# EAGLE design ez-retro-v2 (EAGLE 7.6.0)
CNAME: EZ-Retro; CREVISION: 2; DESIGNER: Jean-Claude Wippler
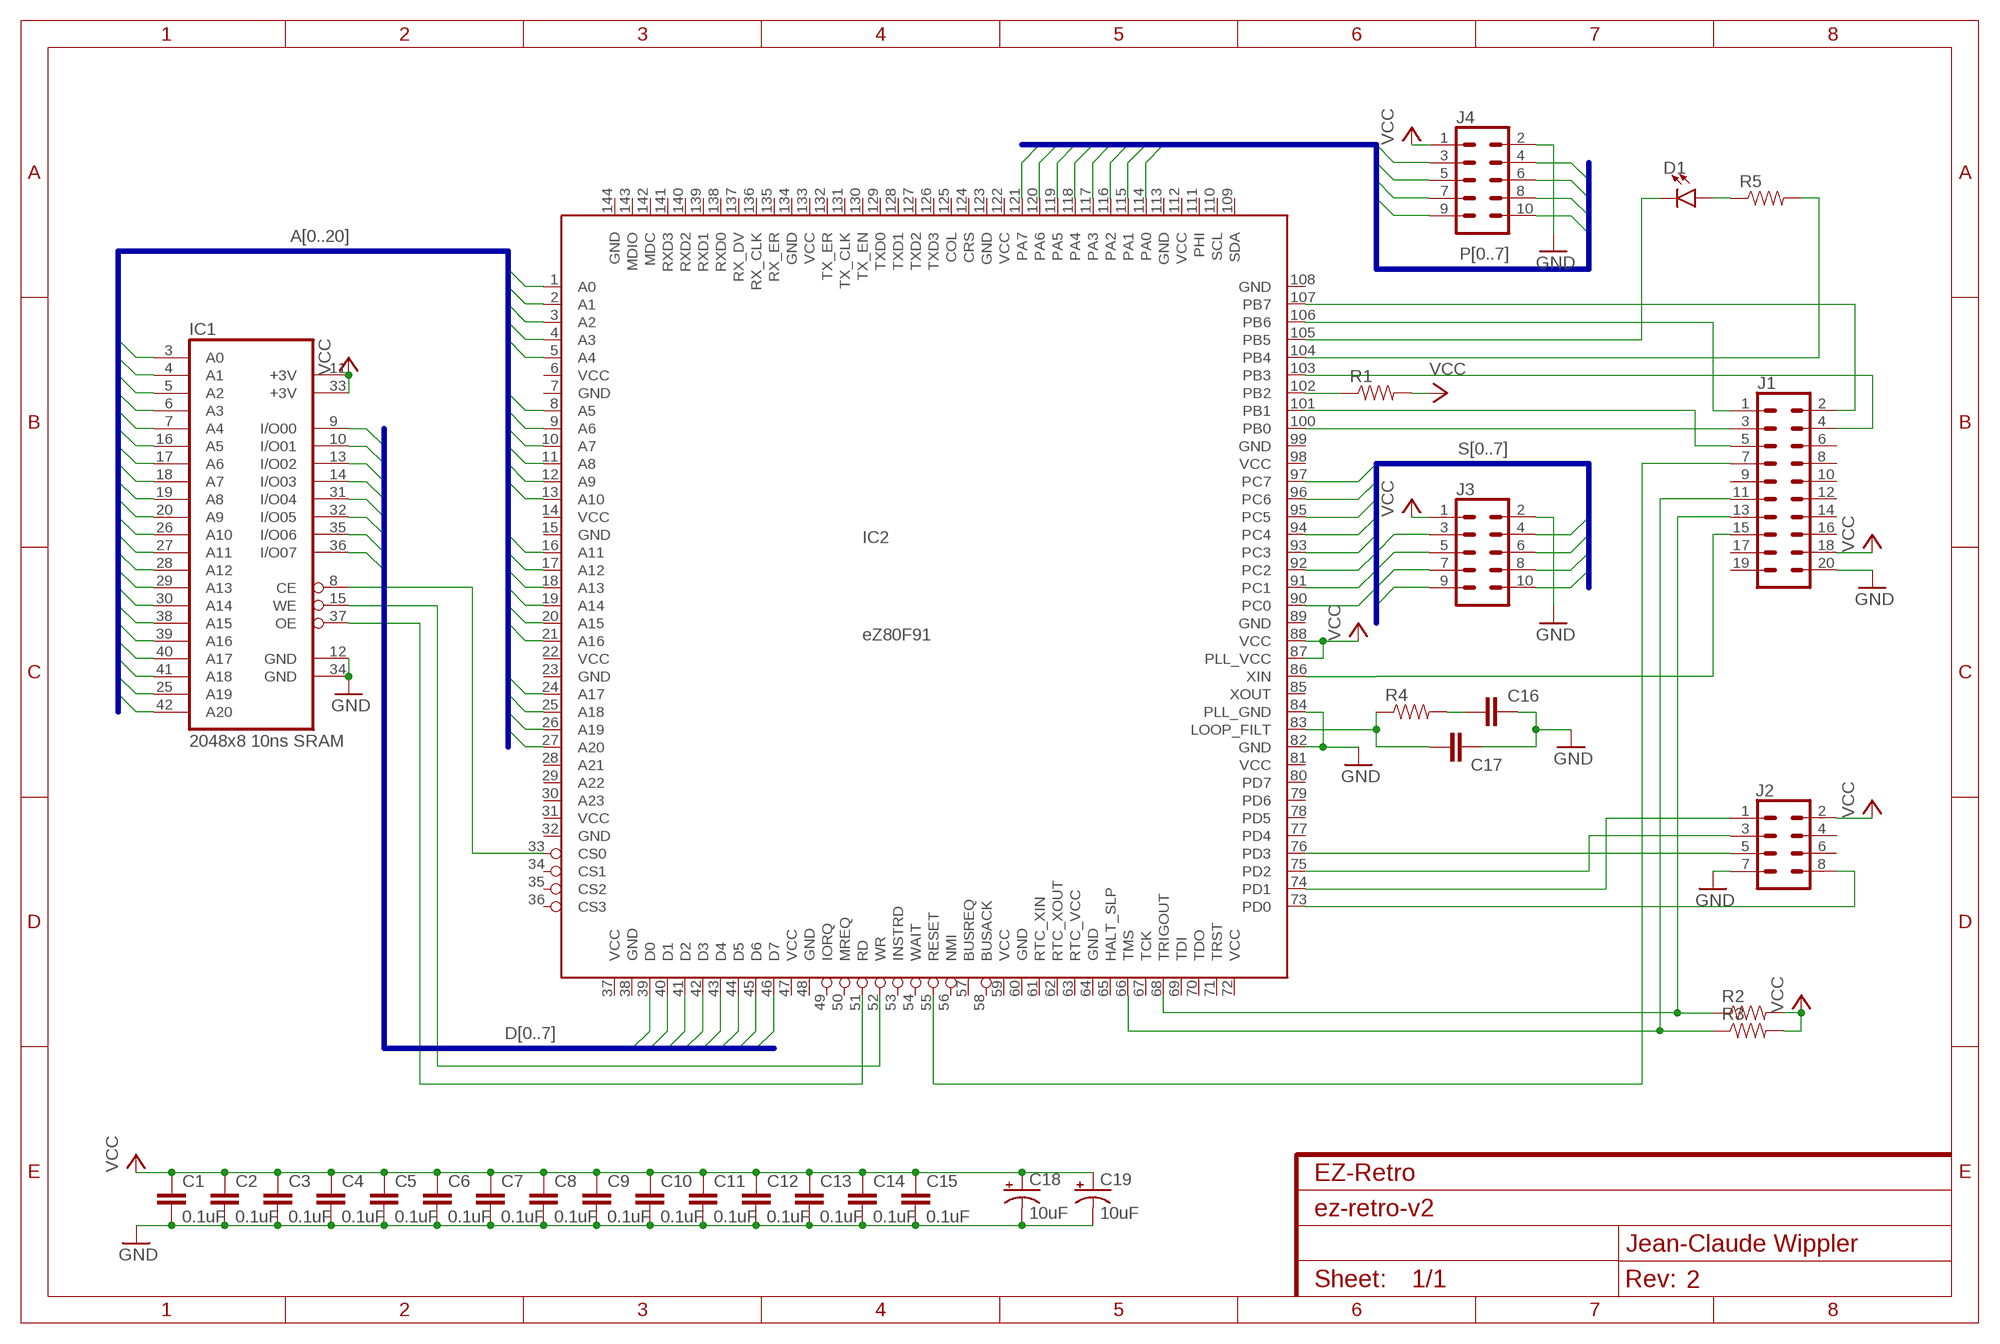
[diagram p0: schematic, sheet 1]

## Parts
C1  0.1uF  0.1UF-0603-25V-(+80/-20%)  [0603]
C2  0.1uF  0.1UF-0603-25V-(+80/-20%)  [0603]
C3  0.1uF  0.1UF-0603-25V-(+80/-20%)  [0603]
C4  0.1uF  0.1UF-0603-25V-(+80/-20%)  [0603]
C5  0.1uF  0.1UF-0603-25V-(+80/-20%)  [0603]
C6  0.1uF  0.1UF-0603-25V-(+80/-20%)  [0603]
C7  0.1uF  0.1UF-0603-25V-(+80/-20%)  [0603]
C8  0.1uF  0.1UF-0603-25V-(+80/-20%)  [0603]
C9  0.1uF  0.1UF-0603-25V-(+80/-20%)  [0603]
C10  0.1uF  0.1UF-0603-25V-(+80/-20%)  [0603]
C11  0.1uF  0.1UF-0603-25V-(+80/-20%)  [0603]
C12  0.1uF  0.1UF-0603-25V-(+80/-20%)  [0603]
C13  0.1uF  0.1UF-0603-25V-(+80/-20%)  [0603]
C14  0.1uF  0.1UF-0603-25V-(+80/-20%)  [0603]
C15  0.1uF  0.1UF-0603-25V-(+80/-20%)  [0603]
C16  0.1uF  0.1UF-0603-25V-(+80/-20%)  [0603]
C17  0.1uF  0.1UF-0603-25V-(+80/-20%)  [0603]
C18  10uF  10UF-POLAR-EIA3216-16V-10%(TANT)  [EIA3216]
C19  10uF  10UF-POLAR-EIA3216-16V-10%(TANT)  [EIA3216]
D1  LED1206  [LED-1206]
IC1  2048x8 10ns SRAM  CY7C1059DV33-10ZSXI  [TSOPII-Z44]
IC2  eZ80F91  EZ80F91-T144  [TQFP144]
J1  CONN_10X2NOSILK  [2X10_NOSILK]
J2  CONN_04X2  [2X4]
J3  CONN_05X2NO_SILK  [2X5_NOSILK]
J4  CONN_05X2NO_SILK  [2X5_NOSILK]
R1  RESISTOR0603-RES  [0603-RES]
R2  RESISTOR0603-RES  [0603-RES]
R3  RESISTOR0603-RES  [0603-RES]
R4  RESISTOR0603-RES  [0603-RES]
R5  RESISTOR0603-RES  [0603-RES]

## Nets
A0: IC1.3(A0) IC2.1(A0)
A1: IC1.4(A1) IC2.2(A1)
A2: IC1.5(A2) IC2.3(A2)
A3: IC1.6(A3) IC2.4(A3)
A4: IC1.7(A4) IC2.5(A4)
A5: IC1.16(A5) IC2.8(A5)
A6: IC1.17(A6) IC2.9(A6)
A7: IC1.18(A7) IC2.10(A7)
A8: IC1.19(A8) IC2.11(A8)
A9: IC1.20(A9) IC2.12(A9)
A10: IC1.26(A10) IC2.13(A10)
A11: IC1.27(A11) IC2.16(A11)
A12: IC1.28(A12) IC2.17(A12)
A13: IC1.29(A13) IC2.18(A13)
A14: IC1.30(A14) IC2.19(A14)
A15: IC1.38(A15) IC2.20(A15)
A16: IC1.39(A16) IC2.21(A16)
A17: IC1.40(A17) IC2.24(A17)
A18: IC1.41(A18) IC2.25(A18)
A19: IC1.25(A19) IC2.26(A19)
A20: IC1.42(A20) IC2.27(A20)
D0: IC1.9(I/O00) IC2.39(D0)
D1: IC1.10(I/O01) IC2.40(D1)
D2: IC1.13(I/O02) IC2.41(D2)
D3: IC1.14(I/O03) IC2.42(D3)
D4: IC1.31(I/O04) IC2.43(D4)
D5: IC1.32(I/O05) IC2.44(D5)
D6: IC1.35(I/O06) IC2.45(D6)
D7: IC1.36(I/O07) IC2.46(D7)
GND [power]: C1.2 C2.2 C3.2 C4.2 C5.2 C6.2 C7.2 C8.2 C9.1 C10.2 C11.2 C12.2 C13.2 C14.2 C15.2 C16.2 C17.2 C18.- C19.- IC1.12(GND) IC1.34(GND) IC2.82(GND) IC2.84(PLL_GND) J1.20 J2.7 J3.2 J4.2
N$1: IC1.37(OE) IC2.51(RD)
N$2: IC1.15(WE) IC2.52(WR)
N$3: IC1.8(CE) IC2.33(CS0)
N$4: IC2.100(PB0) J1.3
N$5: IC2.106(PB6) J1.1
N$6: IC2.103(PB3) J1.4
N$7: IC2.107(PB7) J1.2
N$8: IC2.86(XIN) J1.15
N$9: IC2.55(RESET) J1.7
N$10: IC2.101(PB1) J1.5
N$11: IC2.66(TMS) J1.11 R3.1
N$12: IC2.102(PB2) R1.1
N$13: IC2.68(TRIGOUT) J1.13 R2.1
N$14: IC2.74(PD1) J2.1
N$15: IC2.73(PD0) J2.8
N$16: IC2.76(PD3) J2.5
N$17: IC2.75(PD2) J2.3
N$18: C17.1 IC2.83(LOOP_FILT) R4.1
N$19: C16.1 R4.2
N$20: D1.A R5.1
N$21: D1.C IC2.105(PB5)
N$22: IC2.104(PB4) R5.2
P0: IC2.114(PA0) J4.3
P1: IC2.115(PA1) J4.4
P2: IC2.116(PA2) J4.5
P3: IC2.117(PA3) J4.6
P4: IC2.118(PA4) J4.7
P5: IC2.119(PA5) J4.8
P6: IC2.120(PA6) J4.9
P7: IC2.121(PA7) J4.10
S0: IC2.90(PC0) J3.3
S1: IC2.91(PC1) J3.4
S2: IC2.92(PC2) J3.5
S3: IC2.93(PC3) J3.6
S4: IC2.94(PC4) J3.7
S5: IC2.95(PC5) J3.8
S6: IC2.96(PC6) J3.9
S7: IC2.97(PC7) J3.10
VCC [power]: C1.1 C2.1 C3.1 C4.1 C5.1 C6.1 C7.1 C8.1 C9.2 C10.1 C11.1 C12.1 C13.1 C14.1 C15.1 C18.+ C19.+ IC1.11(+3V) IC1.33(+3V) IC2.87(PLL_VCC) IC2.88(VCC) J1.18 J2.2 J3.1 J4.1 R1.2 R2.2 R3.2
Unconnected: IC2.28(A21) IC2.29(A22) IC2.30(A23) IC2.34(CS1) IC2.35(CS2) IC2.36(CS3) IC2.49(IORQ) IC2.50(MREQ) IC2.53(INSTRD) IC2.54(WAIT) IC2.56(NMI) IC2.57(BUSREQ) IC2.58(BUSACK) IC2.61(RTC_XIN) IC2.62(RTC_XOUT) IC2.65(HALT_SLP) IC2.67(TCK) IC2.69(TDI) IC2.70(TDO) IC2.71(TRST) IC2.77(PD4) IC2.78(PD5) IC2.79(PD6) IC2.80(PD7) IC2.85(XOUT) IC2.109(SDA) IC2.110(SCL) IC2.111(PHI) IC2.124(CRS) IC2.125(COL) IC2.126(TXD3) IC2.127(TXD2) IC2.128(TXD1) IC2.129(TXD0) IC2.130(TX_EN) IC2.131(TX_CLK) IC2.132(TX_ER) IC2.135(RX_ER) IC2.136(RX_CLK) IC2.137(RX_DV) IC2.138(RXD0) IC2.139(RXD1) IC2.140(RXD2) IC2.141(RXD3) IC2.142(MDC) IC2.143(MDIO) J1.6 J1.8 J1.9 J1.10 J1.12 J1.14 J1.16 J1.17 J1.19 J2.4 J2.6

## Buses
A[0..20]
D[0..7]
P[0..7]
S[0..7]

## Power pins joined to a net without a drawn wire
GND: IC2.7(GND) IC2.15(GND) IC2.23(GND) IC2.32(GND) IC2.38(GND) IC2.48(GND) IC2.60(GND) IC2.64(GND) IC2.89(GND) IC2.99(GND) IC2.108(GND) IC2.113(GND) IC2.123(GND) IC2.134(GND)
RTC_VCC: IC2.63(RTC_VCC)
VCC: IC2.6(VCC) IC2.14(VCC) IC2.22(VCC) IC2.31(VCC) IC2.37(VCC) IC2.47(VCC) IC2.59(VCC) IC2.72(VCC) IC2.81(VCC) IC2.98(VCC) IC2.112(VCC) IC2.122(VCC) IC2.133(VCC)
WP: IC2.144(WP)

## Library data of the parts
C1-C17 = SparkFun-Capacitors:0.1UF: 0.1µF ceramic capacitors A capacitor is a passive two-terminal electrical component used to store electrical energy temporarily in an electric field.; PROD_ID: CAP-00810
C18 C19 = SparkFun-Capacitors:10UF-POLAR: 10.0µF polarized capacitors A capacitor is a passive two-terminal electrical component used to store electrical energy temporarily in an electric field.; PROD_ID: CAP-00811
D1 = SparkFun-LED:LED: LED (Generic) Standard schematic elements and footprints for 5mm, 3mm, 1206, and 0603 sized LEDs. Generic LEDs with no color specified.
IC1 = JeeLabs:CY7C1059DV33: Source: CYPRESS cy7c1059dv33_8.pdf
IC2 = JeeLabs:EZ80F91-T144: Zilog eZ80F91; OC_FARNELL: unknown; OC_NEWARK: unknown
J1 = SparkFun-Connectors:CONN_10X2: Multi connection point. Often used as Generic Header-pin footprint for 0.1 inch spaced/style header connections On any of the 0.1 inch spaced packages, you can populate with these: Break Away Headers - Straight <https://www.sparkfun.com/products/116> (PRT-00116) Break Away Male Headers - Right Angle <https://www.sparkfun.com/products/553> (PRT-00553) Female Headers <https://www.sparkfun.com/products/115> (PRT-00115) Break Away Headers - Machine Pin <https://www.sparkfun.com/products/117> (PRT-00117) Break Away Female Headers - Swiss Machine Pin <https://www.sparkfun.com/products/743> (PRT-00743) Special note about the "SPECIAL" package: This was SPECIALLY designed to be used with our Graphic LCD Backpack. Be sure you want to use this! It is not only staggered on each line of header holes, but IT IS ALSO offset of the center point of the top and bottom lines by 5 mil. This causes the headers to lock into place on the "standard" footprint on the LCD screen. The extra squares on the tdocu layer are there simply to reference other pins (if you were to actually populate a longer header than ten long - this is what we do with the backpacks).
J2 = SparkFun-Connectors:CONN_04X2: Multi connection point. Often used as Generic Header-pin footprint for 0.1 inch spaced/style header connections On any of the 0.1 inch spaced packages, you can populate with these: Break Away Headers - Straight <https://www.sparkfun.com/products/116> (PRT-00116) Break Away Male Headers - Right Angle <https://www.sparkfun.com/products/553> (PRT-00553) Female Headers <https://www.sparkfun.com/products/115> (PRT-00115) Break Away Headers - Machine Pin <https://www.sparkfun.com/products/117> (PRT-00117) Break Away Female Headers - Swiss Machine Pin <https://www.sparkfun.com/products/743> (PRT-00743)
J3 J4 = SparkFun-Connectors:CONN_05X2: Multi connection point. Often used as Generic Header-pin footprint for 0.1 inch spaced/style header connections For AVR SPI programming port, see special device with nice symbol: "AVR_SPI_PROG_5x2.dev" You can populate with any combo of single row headers, but if you'd like an exact match, check these: 2x5 AVR ICSP Male Header <https://www.sparkfun.com/products/778> (PRT-00778) 2x5 Pin Shrouded Header <https://www.sparkfun.com/products/8506> (PRT-08506) On any of the 0.1 inch spaced packages, you can populate with these: Break Away Headers - Straight <https://www.sparkfun.com/products/116> (PRT-00116) Break Away Male Headers - Right Angle <https://www.sparkfun.com/products/553> (PRT-00553) Female Headers <https://www.sparkfun.com/products/115> (PRT-00115) Break Away Headers - Machine Pin <https://www.sparkfun.com/products/117> (PRT-00117) Break Away Female Headers - Swiss Machine Pin <https://www.sparkfun.com/products/743> (PRT-00743) Special note: the shrouded connector mates well with our 5x2 ribbon cables: 2x5 Pin IDC Ribbon Cable <https://www.sparkfun.com/products/8535> (PRT-08535)
R1-R5 = SparkFun-Passives:RESISTOR: Resistor Basic schematic elements and footprints for 0603, 1206, and PTH resistors.

## Net classes
1 power: width 0.254 mm

## Board
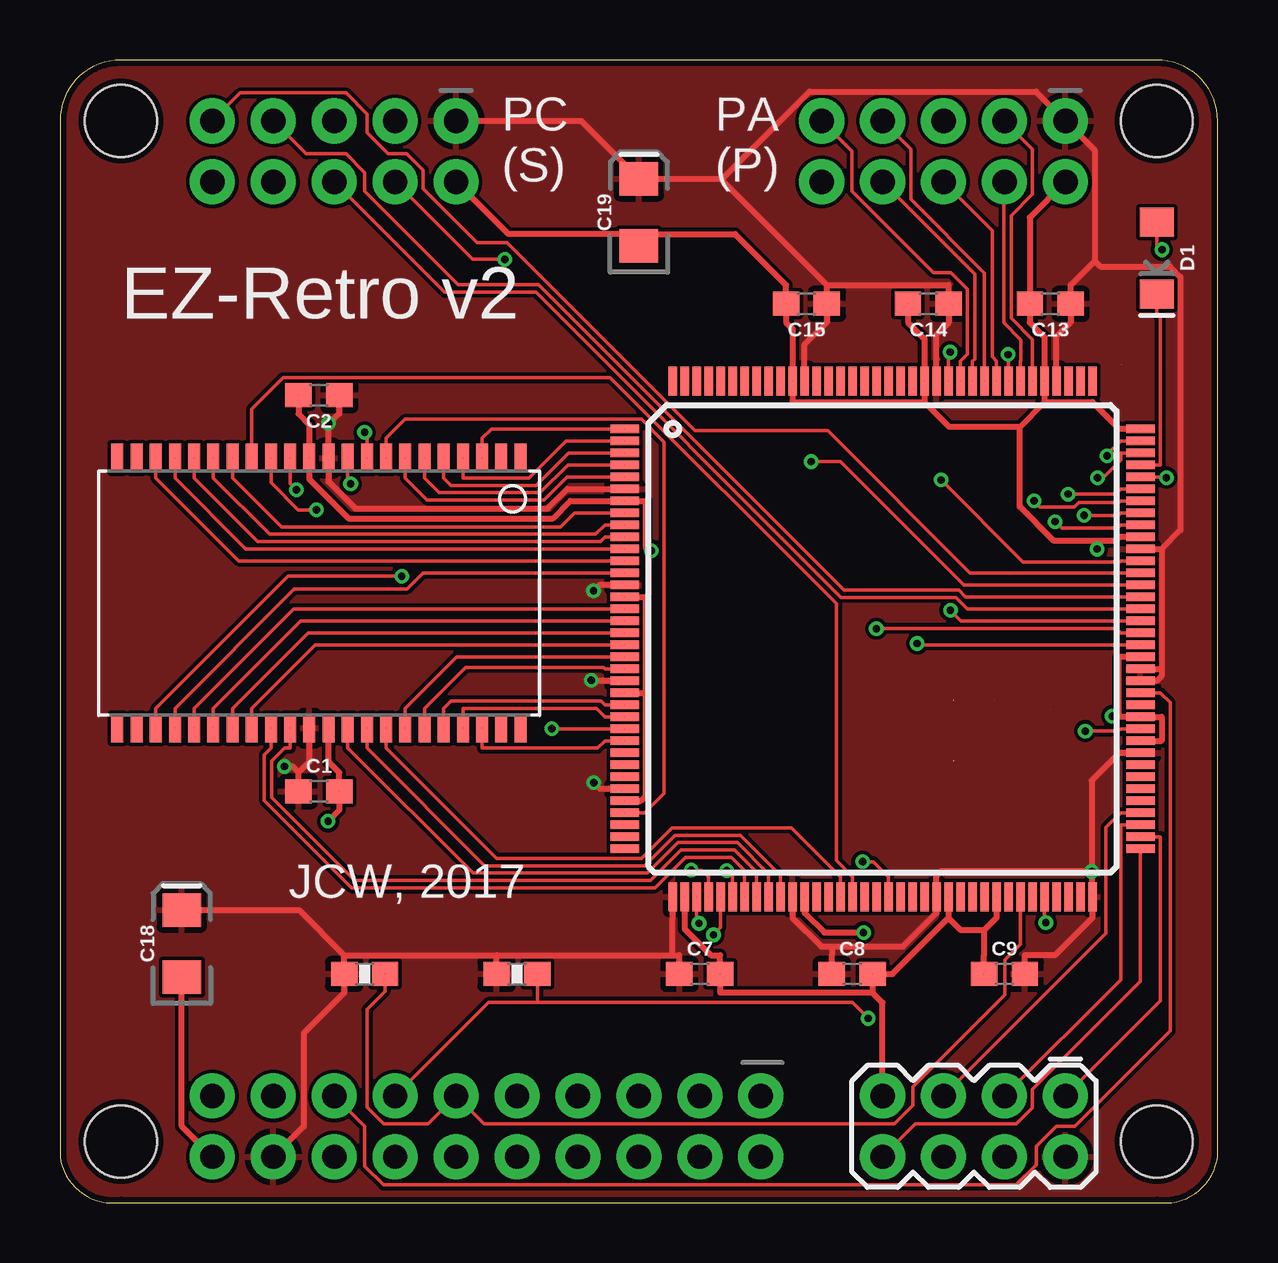
[diagram p1: board, top side]
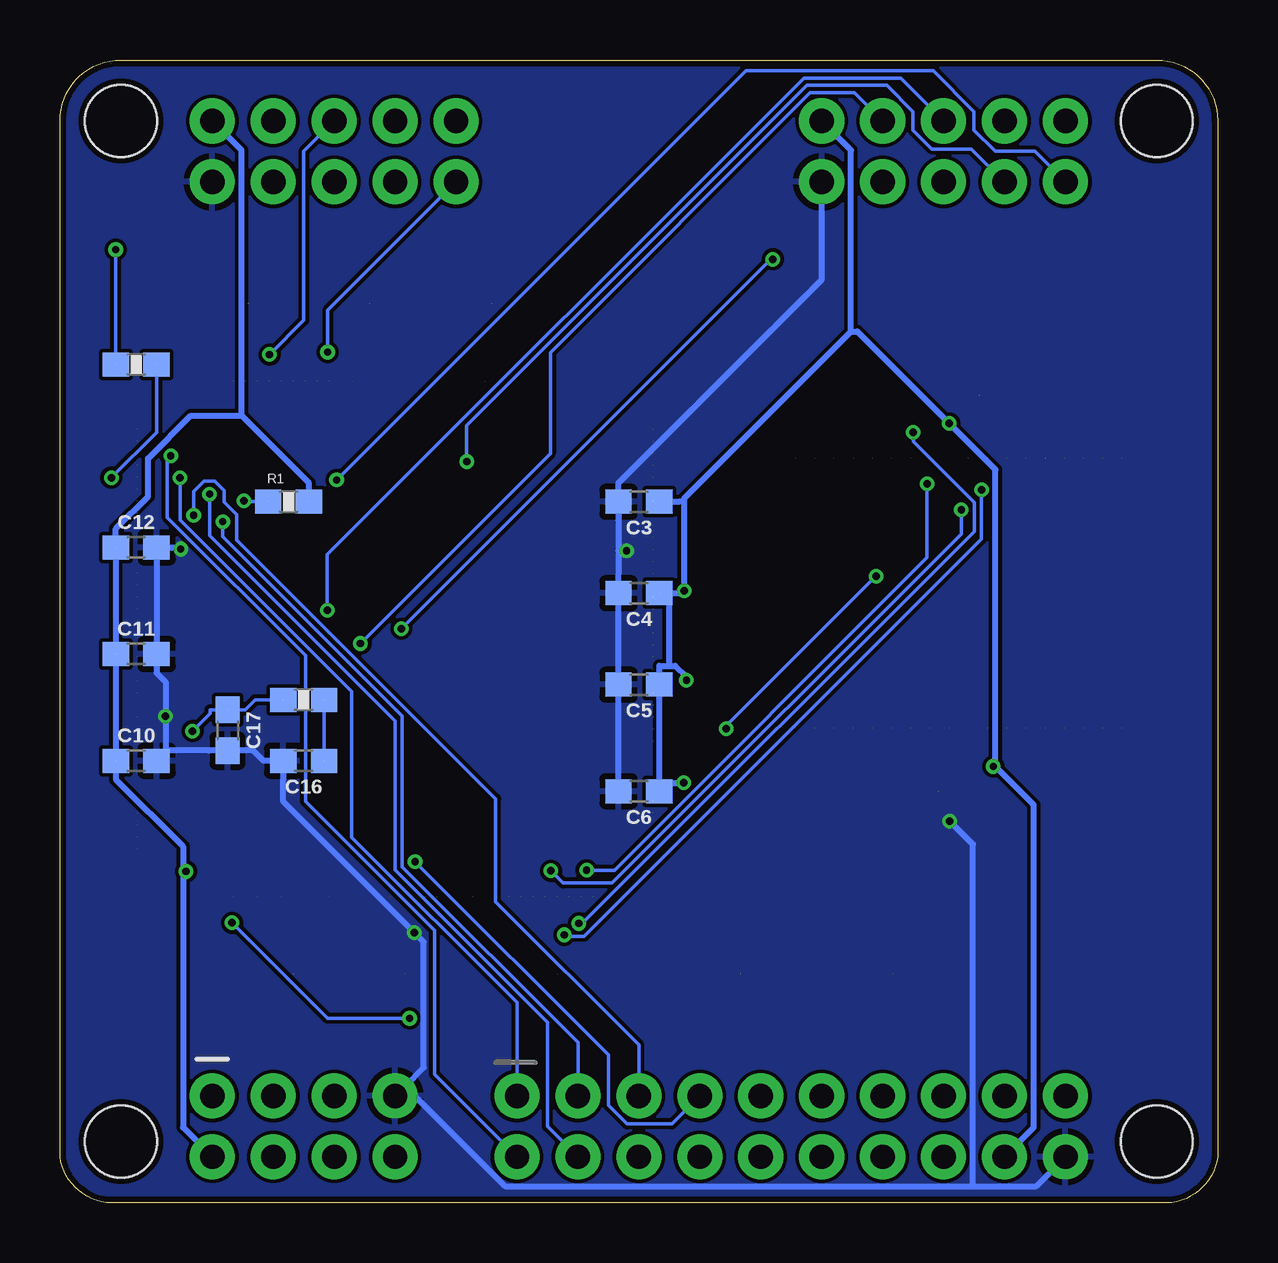
[diagram p2: board, bottom side, seen from below]

Size 48.26 x 47.65 mm. Coordinates in mm from the lower left corner, seen from the top.
Outline: 0,45.11 0,1.93 arc90 2.54,0.02 45.72,0.02 arc90 48.26,1.93 48.26,45.11 arc90 45.72,47.65 2.54,47.65 arc90 0,45.11
Copper layers (1*16): Top 0.035mm / dielectric 1.5mm / Bottom 0.035mm
Design rules "ITEADstudio_DRC": minimum track width 6mil, minimum drill 12mil, track to track 6mil, track to pad 6mil, pad to pad 6mil, via to via 6mil, smd to smd 0mil, copper to edge 10mil, drill to drill 10mil, minimum pad ring 10mil, minimum via ring 6mil, stop-mask expansion 2mil, vias tented up to drill 100mil, thermal gap 10mil
Holes 3 mm at 2.54,2.56 45.72,2.56 45.72,45.11 2.54,45.11

### Footprints (pad centres in the part's own frame; a part is rotated, then mirrored left to right if it is on the bottom)
0603 = smd 1.1 x 1: 1 -0.85,0; 2 0.85,0
EIA3216 = smd 1.4 x 1.6: + 1.4,0; - -1.4,0
LED-1206 = smd 1.2 x 1.4: A -1.5,0; C 1.5,0
TSOPII-Z44 = smd 0.5 x 1.2: 1 -8.4,-5.627; 2 -7.6,-5.627; 3 -6.8,-5.627; 4 -6,-5.627; 5 -5.2,-5.627; 6 -4.4,-5.627; 7 -3.6,-5.627; 8 -2.8,-5.627; 9 -2,-5.627; 10 -1.2,-5.627; 11 -0.4,-5.627; 12 0.4,-5.627; 13 1.2,-5.627; 14 2,-5.627; 15 2.8,-5.627; 16 3.6,-5.627; 17 4.4,-5.627; 18 5.2,-5.627; 19 6,-5.627; 20 6.8,-5.627; 21 7.6,-5.627; 22 8.4,-5.627; 23 8.4,5.627; 24 7.6,5.627; 25 6.8,5.627; 26 6,5.627; 27 5.2,5.627; 28 4.4,5.627; 29 3.6,5.627; 30 2.8,5.627; 31 2,5.627; 32 1.2,5.627; 33 0.4,5.627; 34 -0.4,5.627; 35 -1.2,5.627; 36 -2,5.627; 37 -2.8,5.627; 38 -3.6,5.627; 39 -4.4,5.627; 40 -5.2,5.627; 41 -6,5.627; 42 -6.8,5.627; 43 -7.6,5.627; 44 -8.4,5.627
TQFP144 = smd 1.2 x 0.35: 1 -10.75,8.75; 2 -10.75,8.25; 3 -10.75,7.75; 4 -10.75,7.25; 5 -10.75,6.75; 6 -10.75,6.25; 7 -10.75,5.75; 8 -10.75,5.25; 9 -10.75,4.75; 10 -10.75,4.25; 11 -10.75,3.75; 12 -10.75,3.25; 13 -10.75,2.75; 14 -10.75,2.25; 15 -10.75,1.75; 16 -10.75,1.25; 17 -10.75,0.75; 18 -10.75,0.25; 19 -10.75,-0.25; 20 -10.75,-0.75; 21 -10.75,-1.25; 22 -10.75,-1.75; 23 -10.75,-2.25; 24 -10.75,-2.75; 25 -10.75,-3.25; 26 -10.75,-3.75; 27 -10.75,-4.25; 28 -10.75,-4.75; 29 -10.75,-5.25; 30 -10.75,-5.75; 31 -10.75,-6.25; 32 -10.75,-6.75; 33 -10.75,-7.25; 34 -10.75,-7.75; 35 -10.75,-8.25; 36 -10.75,-8.75; 73 10.75,-8.75; 74 10.75,-8.25; 75 10.75,-7.75; 76 10.75,-7.25; 77 10.75,-6.75; 78 10.75,-6.25; 79 10.75,-5.75; 80 10.75,-5.25; 81 10.75,-4.75; 82 10.75,-4.25; 83 10.75,-3.75; 84 10.75,-3.25; 85 10.75,-2.75; 86 10.75,-2.25; 87 10.75,-1.75; 88 10.75,-1.25; 89 10.75,-0.75; 90 10.75,-0.25; 91 10.75,0.25; 92 10.75,0.75; 93 10.75,1.25; 94 10.75,1.75; 95 10.75,2.25; 96 10.75,2.75; 97 10.75,3.25; 98 10.75,3.75; 99 10.75,4.25; 100 10.75,4.75; 101 10.75,5.25; 102 10.75,5.75; 103 10.75,6.25; 104 10.75,6.75; 105 10.75,7.25; 106 10.75,7.75; 107 10.75,8.25; 108 10.75,8.75 | smd 0.35 x 1.2: 37 -8.75,-10.75; 38 -8.25,-10.75; 39 -7.75,-10.75; 40 -7.25,-10.75; 41 -6.75,-10.75; 42 -6.25,-10.75; 43 -5.75,-10.75; 44 -5.25,-10.75; 45 -4.75,-10.75; 46 -4.25,-10.75; 47 -3.75,-10.75; 48 -3.25,-10.75; 49 -2.75,-10.75; 50 -2.25,-10.75; 51 -1.75,-10.75; 52 -1.25,-10.75; 53 -0.75,-10.75; 54 -0.25,-10.75; 55 0.25,-10.75; 56 0.75,-10.75; 57 1.25,-10.75; 58 1.75,-10.75; 59 2.25,-10.75; 60 2.75,-10.75; 61 3.25,-10.75; 62 3.75,-10.75; 63 4.25,-10.75; 64 4.75,-10.75; 65 5.25,-10.75; 66 5.75,-10.75; 67 6.25,-10.75; 68 6.75,-10.75; 69 7.25,-10.75; 70 7.75,-10.75; 71 8.25,-10.75; 72 8.75,-10.75; 109 8.75,10.75; 110 8.25,10.75; 111 7.75,10.75; 112 7.25,10.75; 113 6.75,10.75; 114 6.25,10.75; 115 5.75,10.75; 116 5.25,10.75; 117 4.75,10.75; 118 4.25,10.75; 119 3.75,10.75; 120 3.25,10.75; 121 2.75,10.75; 122 2.25,10.75; 123 1.75,10.75; 124 1.25,10.75; 125 0.75,10.75; 126 0.25,10.75; 127 -0.25,10.75; 128 -0.75,10.75; 129 -1.25,10.75; 130 -1.75,10.75; 131 -2.25,10.75; 132 -2.75,10.75; 133 -3.25,10.75; 134 -3.75,10.75; 135 -4.25,10.75; 136 -4.75,10.75; 137 -5.25,10.75; 138 -5.75,10.75; 139 -6.25,10.75; 140 -6.75,10.75; 141 -7.25,10.75; 142 -7.75,10.75; 143 -8.25,10.75; 144 -8.75,10.75
2X10_NOSILK = drill 1.016 pad 1.88: 1 0,0; 2 0,2.54; 3 2.54,0; 4 2.54,2.54; 5 5.08,0; 6 5.08,2.54; 7 7.62,0; 8 7.62,2.54; 9 10.16,0; 10 10.16,2.54; 11 12.7,0; 12 12.7,2.54; 13 15.24,0; 14 15.24,2.54; 15 17.78,0; 16 17.78,2.54; 17 20.32,0; 18 20.32,2.54; 19 22.86,0; 20 22.86,2.54
2X4 = drill 1.016 pad 1.88: 1 -3.81,-1.27; 2 -3.81,1.27; 3 -1.27,-1.27; 4 -1.27,1.27; 5 1.27,-1.27; 6 1.27,1.27; 7 3.81,-1.27; 8 3.81,1.27
2X5_NOSILK = drill 1.016 pad 1.88: 1 0,0; 2 0,2.54; 3 2.54,0; 4 2.54,2.54; 5 5.08,0; 6 5.08,2.54; 7 7.62,0; 8 7.62,2.54; 9 10.16,0; 10 10.16,2.54
0603-RES = smd 1.1 x 1: 1 -0.85,0; 2 0.85,0

### Placement (x,y rotation side)
C1  10.79,17.17 0 top
C2  10.79,33.68 180 top
C3  24.13,29.23 180 bottom
C4  24.13,25.42 180 bottom
C5  24.13,21.61 180 bottom
C6  24.13,17.17 180 bottom
C7  26.67,9.55 0 top
C8  33.02,9.55 0 top
C9  39.37,9.55 0 top
C10  45.09,18.44 0 bottom
C11  45.09,22.88 0 bottom
C12  45.09,27.33 0 bottom
C13  41.27,37.49 180 top
C14  36.2,37.49 180 top
C15  31.11,37.49 180 top
C16  38.1,18.44 180 bottom
C17  41.27,19.71 270 bottom
C18  5.08,10.82 90 top
C19  24.13,41.3 90 top
D1  45.72,39.39 270 top
IC1  10.79,25.42 180 top
IC2  34.29,23.52 0 top
J1  29.21,4.47 180 top
J2  38.1,3.2 180 top
J3  16.51,45.11 180 top
J4  41.91,45.11 180 top
R1  38.73,29.23 0 bottom
R2  19.05,9.55 180 top
R3  12.7,9.55 180 top
R4  38.1,20.98 0 bottom
R5  45.09,34.95 0 bottom

### Tracks (layer width: path | path; a pad name or v marks a point on that pad's centre or on a via)
A0  (2 unrouted)
  Top 0.152: IC1.3 17.59,31.88 17.98,32.27 IC2.1
A1  (2 unrouted)
  Top 0.152: IC1.4 16.8,30.22 19.55,30.22 21.09,31.77 IC2.2
A2  (2 unrouted)
  Top 0.152: IC1.5 15.99,30.22 16.3,29.91 19.84,29.91 21.2,31.27 IC2.3
A3  (2 unrouted)
  Top 0.152: IC2.4 22.71,30.77 | 22.71,30.77 21.18,30.77 20.02,29.61 15.81,29.61 15.2,30.22 IC1.6 | 22.71,30.77
A4  (2 unrouted)
  Top 0.152: IC1.7 14.39,30.22 15.31,29.3 20.18,29.3 21.15,30.27 22.71,30.27 IC2.5
A5  (2 unrouted)
  Top 0.152: IC2.8 21.44,28.77 20.86,28.18 9.23,28.18 7.2,30.22 IC1.16
A6  (2 unrouted)
  Top 0.152: IC1.17 6.39,30.22 8.73,27.88 22.33,27.88 22.71,28.27 IC2.9
A7  (2 unrouted)
  Top 0.152: IC2.10 22.71,27.77 22.52,27.57 8.24,27.57 5.59,30.22 IC1.18
A8  (2 unrouted)
  Top 0.152: IC1.19 4.79,30.22 7.75,27.27 22.71,27.27 IC2.11
A9  (2 unrouted)
  Top 0.152: IC1.20 4,30.22 7.45,26.77 22.71,26.77 IC2.12
A10  (2 unrouted)
  Top 0.152: IC2.13 22.71,26.27 15.13,26.27 14.46,25.6 9.77,25.6 4.79,20.62 IC1.26
A11  (2 unrouted)
  Top 0.152: IC1.27 5.59,20.62 9.74,24.77 IC2.16
A12  (2 unrouted)
  Top 0.152: IC1.28 6.39,20.62 10.04,24.27 IC2.17
A13  (2 unrouted)
  Top 0.152: IC2.18 22.71,23.77 10.34,23.77 7.2,20.62 IC1.29
A14  (2 unrouted)
  Top 0.152: IC2.19 22.71,23.27 10.64,23.27 8,20.62 IC1.30
A15  (2 unrouted)
  Top 0.152: IC1.38 14.39,20.62 16.54,22.77 IC2.20
A16  (2 unrouted)
  Top 0.152: IC2.21 22.71,22.27 22.65,22.32 16.9,22.32 15.2,20.62 IC1.39
A17  (2 unrouted)
  Top 0.152: IC1.40 15.99,20.62 16.3,20.93 22.55,20.93 22.71,20.77 IC2.24
A18  (2 unrouted)
  Top 0.152: IC2.25 22.71,20.27 22.36,20.62 16.8,20.62 IC1.41
A19  (via drill 0.3 pad 0.61)  (2 unrouted)
  Top 0.152: IC2.26 v20.49,19.77 | v14.24,26.13 9.5,26.13 4,20.62 IC1.25
  Bottom 0.152: v14.24,26.13 20.49,19.88 v20.49,19.77
A20  (2 unrouted)
  Top 0.152: IC2.27 22.71,19.27 22.41,18.96 17.59,18.96 IC1.42
D0  (via drill 0.3 pad 0.61)  (2 unrouted)
  Top 0.152: IC2.39 26.54,11.75 v26.64,11.66 | IC1.9 12.79,32.02 v12.7,32.12
  Bottom 0.152: v12.7,32.12 12.7,31.73 10.15,29.19 10.15,28 26.49,11.66 v26.64,11.66
D1  (via drill 0.3 pad 0.61)  (2 unrouted)
  Top 0.152: v26.31,13.87 26.76,13.87 27.04,13.59 IC2.40 | v12.12,29.97 12.12,30.1 11.99,30.22 IC1.10
  Bottom 0.152: v12.12,29.97 12.12,26.9 25.14,13.87 v26.31,13.87
D2  (via drill 0.3 pad 0.61)  (2 unrouted)
  Top 0.152: IC2.41 27.54,11.48 v27.24,11.18 | IC1.13 9.6,29.98 v9.85,29.73
  Bottom 0.152: v9.85,29.73 9.85,27.68 26.41,11.12 27.18,11.12 v27.24,11.18
D3  (via drill 0.3 pad 0.61)  (2 unrouted)
  Top 0.152: v10.69,28.89 9.92,28.89 8.79,30.02 8.79,30.22 IC1.14 | IC2.42 28.04,13.61 v27.8,13.85
  Bottom 0.152: v10.69,28.89 10.69,27.89 25.25,13.33 27.28,13.33 v27.8,13.85
D4  (2 unrouted)
  Top 0.152: IC1.31 8.79,18.96 8.51,18.68 8.51,16.78 12.16,13.14 24.81,13.14 26.08,14.41 28,14.41 28.54,13.86 28.54,13.59 IC2.43
D5  (2 unrouted)
  Top 0.152: IC2.44 29.04,13.59 29.04,13.79 28.12,14.71 25.89,14.71 24.61,13.44 12.29,13.44 8.82,16.91 8.82,18.42 9.37,18.96 9.6,18.96 IC1.32
D6  (2 unrouted)
  Top 0.152: IC1.35 11.99,18.96 17.21,13.75 24.49,13.75 25.77,15.03 28.24,15.03 29.54,13.72 29.54,13.59 IC2.45
D7  (2 unrouted)
  Top 0.152: IC1.36 12.79,18.96 17.7,14.06 24.36,14.06 25.64,15.33 28.36,15.33 30.04,13.66 30.04,13.59 IC2.46
GND  (via drill 0.3 pad 0.61)  (26 unrouted)
  Top 0.254: 24.13,40.39 28.14,40.39 30.27,38.26 C15.2 30.27,36.71 30.54,36.43 IC2.134 30.54,33.39 36.04,33.39 | IC2.48 31.04,12.09 31.86,11.27 v33.49,11.27 | IC2.38 26.04,11.43 27.14,10.32 27.52,10.32 C7.2 27.52,8.77 33.87,8.77 | J2.7 34.29,8.35 33.87,8.77 | v11.17,15.92 11.64,16.39 C1.2 11.64,17.94 11.2,18.39 IC1.34 | 44.13,20.3 44.16,20.27 IC2.84 45.92,20.27 45.92,19.27 IC2.82 | v43.86,20.3 44.13,20.3 | 44.13,20.3 44.13,22.74 44.16,22.77 IC2.89 | 24.42,21.27 24.42,25.27 | IC2.32 24.21,16.77 24.42,16.97 24.42,21.27 | IC2.15 24.42,25.27 | 24.53,27.19 24.53,25.38 24.42,25.27 | 24.53,27.19 24.42,27.3 24.42,29.27 IC2.7 21.27,29.27 20.54,28.54 12.02,28.54 10.39,30.17 IC1.12 10.39,32.45 9.95,32.9 C2.2 | v24.65,27.19 24.53,27.19 | 43.23,27.6 41.43,27.6 40.01,29.03 40.01,32.35 | 43.23,27.6 44,27.6 44.16,27.77 IC2.99 | 43.23,27.6 v43.23,27.26 | 40.01,32.35 41.04,33.39 | 40.01,32.35 37.07,32.35 36.04,33.39 | 36.04,33.39 IC2.123 36.04,36.01 35.34,36.71 C14.2 | IC2.23 24.42,21.27 | J1.20 5.08,3.2 C18.- | IC2.108 44.16,32.27 43.04,33.39 41.04,33.39 | 41.04,33.39 IC2.113 41.04,36.09 40.42,36.71 C13.2 40.42,41.08 J4.2 | 34.7,9.55 C8.2 33.87,8.77 | 37.04,11.89 34.7,9.55 | 34.7,9.55 | 38.52,11.37 37.56,11.37 37.04,11.89 | 38.52,11.37 38.52,10.32 C9.1 | 38.52,11.37 39.04,11.89 IC2.64 | IC2.60 37.04,11.89 | 24.13,40.39 18.69,40.39 J3.2 | C19.- 24.13,40.39
  Bottom 0.254: 33.88,4.87 33.1,5.65 33.1,10.88 v33.49,11.27 38.95,16.73 38.95,17.66 C16.2 39.78,18.44 40.2,18.86 C17.2 42.05,18.86 43.86,18.86 | 10.21,0.71 10.21,14.95 v11.17,15.92 | 33.88,4.87 J2.7 | 33.88,4.87 29.71,0.71 10.21,0.71 | 10.21,0.71 7.57,0.71 J1.20 | J3.2 16.51,38.48 24.98,30.01 C3.2 24.98,28.45 24.98,27.19 | v43.23,27.26 43.34,27.26 43.41,27.33 C12.2 C11.2 44.23,22.1 43.86,21.73 v43.86,20.3 43.86,18.86 | 24.98,27.19 24.98,26.2 C4.2 C5.2 C6.2 | 24.98,27.19 v24.65,27.19 | 43.86,18.86 43.86,18.81 C10.2
  pour Bottom: -1.27,50.19 49.53,50.19 49.53,-3.15 -1.27,-3.15
N$1  (2 unrouted)
  Top 0.152: IC1.37 13.6,18.96 18.2,14.36 24.24,14.36 25.52,15.64 30.5,15.64 32.54,13.59 IC2.51
N$2  (2 unrouted)
  Top 0.152: IC1.15 8,33.1 9.3,34.4 22.93,34.4 32.36,24.98 32.36,14.28 33.04,13.59 IC2.52
N$3  (2 unrouted)
  Top 0.152: IC1.8 13.6,31.88 14.39,32.67 24.23,32.67 25.18,31.72 25.18,17.08 24.37,16.27 IC2.33
N$4  (via drill 0.3 pad 0.61)  (1 unrouted)
  Top 0.152: v41.48,28.4 41.75,28.13 44.07,28.13 44.21,28.27 IC2.100
  Bottom 0.152: J1.3 26.67,6.69 33.99,14.01 33.99,20.31 41.48,27.79 v41.48,28.4 | v41.48,28.4
N$5  (via drill 0.3 pad 0.61)  (1 unrouted)
  Top 0.152: IC2.106 44.21,31.27 44.21,30.96 43.48,30.23 v43.26,30.23
  Bottom 0.152: J1.1 29.21,8.37 36.09,15.25 36.09,21.32 43.26,28.48 v43.26,30.23
N$6  (via drill 0.3 pad 0.61)  (1 unrouted)
  Top 0.152: v42.02,29.55 43.99,29.55 44.21,29.77 IC2.103
  Bottom 0.152: J1.4 27.94,3.2 27.94,7.53 34.29,13.88 34.29,20.1 42.02,27.83 v42.02,29.55 | v42.02,29.55
N$7  (via drill 0.3 pad 0.61)  (1 unrouted)
  Top 0.152: v43.64,31.14 43.64,31.2 44.21,31.77 IC2.107
  Bottom 0.152: J1.2 32.66,5.37 32.66,11.37 38.03,16.74 38.03,22.82 43.79,28.58 43.79,31 v43.64,31.14
N$8  (1 unrouted)
  Top 0.152: IC2.86 45.87,21.27 46.27,20.86 46.27,7.17 42.3,3.2 41.52,3.2 40.69,2.36 40.69,1.59 39.85,0.75 13.49,0.75 12.7,1.54 12.7,3.2 J1.15
N$9  (via drill 0.3 pad 0.61)  (1 unrouted)
  Top 0.152: IC2.55 34.54,13.59 33.91,14.23 v33.46,14.23
  Bottom 0.152: J1.7 22.76,3.3 24.62,3.3 25.4,4.08 25.4,6.17 v33.46,14.23
N$10  (via drill 0.3 pad 0.61)  (1 unrouted)
  Top 0.152: IC2.101 44.21,28.77 44.11,28.66 v42.69,28.66
  Bottom 0.152: J1.5 24.13,6.59 30.1,12.55 30.1,16.84 40.89,27.64 40.89,28.7 41.41,29.22 41.41,29.69 41.81,30.09 42.25,30.09 42.69,29.65 v42.69,28.66
N$11  (2 unrouted)
  Top 0.152: IC2.66 40.04,10.78 39.4,10.13 39.4,8.69 35.56,4.85 35.56,4.08 34.77,3.29 17.68,3.29 J1.11 15.34,3.29 13.49,3.29 12.8,3.98 12.8,8.07 13.55,8.82 R3.1
N$12  (via drill 0.3 pad 0.61)  (2 unrouted)
  Top 0.152: v40.6,29.27 40.85,29.02 42.29,29.02 42.47,29.19 44.14,29.19 44.21,29.27 IC2.102
  Bottom 0.152: R1.1 40.56,29.23 v40.6,29.27
N$13  (via drill 0.3 pad 0.61)  (2 unrouted)
  Top 0.152: 19.9,8.36 17.86,8.36 J1.13 | v33.69,7.7 33.03,8.36 19.9,8.36 | 19.9,8.36 19.9,8.89 R2.1 | v41.09,11.68 41.04,11.74 IC2.68
  Bottom 0.152: v33.69,7.7 37.11,7.7 v41.09,11.68
N$14  (1 unrouted)
  Top 0.152: J2.1 45.87,8.42 45.87,15.27 IC2.74
N$15  (1 unrouted)
  Top 0.152: J2.8 35.66,3.3 39.86,3.3 40.54,3.98 40.54,4.75 45.04,9.25 IC2.73
N$16  (1 unrouted)
  Top 0.152: J2.5 43.6,11.24 43.6,15.66 44.21,16.27 IC2.76
N$17  (1 unrouted)
  Top 0.152: J2.3 44.21,9.31 44.21,15.77 IC2.75
N$18  (via drill 0.3 pad 0.61)  (3 unrouted)
  Top 0.152: IC2.83 44.21,19.77 44.12,19.67 v42.74,19.67
  Bottom 0.152: R4.1 40.13,20.98 40.55,20.56 C17.1 42,20.56 42,20.41 v42.74,19.67
N$19  (2 unrouted)
  Bottom 0.152: R4.2 C16.1
N$20  (via drill 0.3 pad 0.61)  (1 unrouted)
  Top 0.152: D1.A 45.72,39.95 v45.94,39.74
  Bottom 0.152: R5.1 v45.94,39.74
N$21  (1 unrouted)
  Top 0.152: D1.C 45.72,37.06 45.87,36.91 45.87,30.77 IC2.105
N$22  (via drill 0.3 pad 0.61)  (2 unrouted)
  Top 0.152: IC2.104 45.87,30.27 45.9,30.23 v46.12,30.23
  Bottom 0.152: R5.2 44.23,32.12 v46.12,30.23
P0  (1 unrouted)
  Top 0.152: J4.3 40.54,43.94 40.54,42.04 39.65,41.15 39.65,36.89 40.54,35.99 IC2.114
P1  (1 unrouted)
  Top 0.152: IC2.115 40.04,35.09 40.06,35.11 40.06,35.97 39.34,36.69 39.34,42.53 J4.4
P2  (via drill 0.3 pad 0.61)  (1 unrouted)
  Top 0.152: IC2.116 39.54,35.35 v39.52,35.37
  Bottom 0.152: J4.5 38.1,43.84 38.1,36.79 v39.52,35.37
P3  (1 unrouted)
  Top 0.152: J4.6 38.86,40.54 38.86,35.28 39.04,35.09 IC2.117
P4  (1 unrouted)
  Top 0.152: J4.7 35.46,43.94 35.46,41.85 38.54,38.77 38.54,35.09 IC2.118
P5  (1 unrouted)
  Top 0.152: IC2.119 38.04,35.09 38.13,35.18 38.13,38.73 J4.8
P6  (1 unrouted)
  Top 0.152: IC2.120 37.54,35.09 37.82,35.38 37.82,38.09 37.13,38.79 36.42,38.79 33.02,42.18 33.02,43.84 J4.9
P7  (via drill 0.3 pad 0.61)  (1 unrouted)
  Top 0.152: v37.1,35.47 37.04,35.41 IC2.121
  Bottom 0.152: J4.10 37.1,37.21 v37.1,35.47
S0  (via drill 0.3 pad 0.61)  (1 unrouted)
  Top 0.152: v35.73,23.32 35.79,23.27 44.21,23.27 IC2.90
  Bottom 0.152: J3.3 15.14,46.28 16.99,46.28 27.82,35.46 27.82,31.24 v35.73,23.32
S1  (via drill 0.3 pad 0.61)  (1 unrouted)
  Top 0.152: v34.03,23.94 44.04,23.94 44.21,23.77 IC2.91 | J3.4 17.2,39.34 v18.55,39.34
  Bottom 0.152: v18.55,39.34 18.63,39.34 v34.03,23.94
S2  (via drill 0.3 pad 0.61)  (1 unrouted)
  Top 0.152: v37.12,24.71 37.56,24.27 44.21,24.27 IC2.92
  Bottom 0.152: J3.5 13.21,46.89 17.25,46.89 37.12,27.02 v37.12,24.71
S3  (1 unrouted)
  Top 0.152: J3.6 16.04,37.96 19.84,37.96 32.55,25.24 37.34,25.24 37.82,24.77 44.21,24.77 IC2.93
S4  (1 unrouted)
  Top 0.152: J3.7 10.26,43.73 11.92,43.73 12.7,42.95 12.7,42.18 16.6,38.28 19.95,38.28 32.68,25.55 37.47,25.55 37.75,25.27 44.21,25.27 IC2.94
S5  (via drill 0.3 pad 0.61)  (1 unrouted)
  Top 0.152: v31.31,30.9 32.54,30.9 37.68,25.77 44.21,25.77 IC2.95
  Bottom 0.152: J3.8 10.26,43.94 11.91,43.94 12.7,44.72 12.7,45.49 13.79,46.58 17.12,46.58 31.31,32.4 v31.31,30.9
S6  (1 unrouted)
  Top 0.152: J3.9 7.52,46.28 11.92,46.28 12.8,45.39 12.8,44.61 13.68,43.73 14.46,43.73 15.14,43.05 15.14,42.28 17.39,40.03 18.63,40.03 26.47,32.19 32.01,32.19 37.94,26.27 IC2.96
S7  (via drill 0.3 pad 0.61)  (1 unrouted)
  Top 0.152: IC2.97 44.21,26.77 44.17,26.72 40.15,26.72 v36.73,30.14
  Bottom 0.152: J3.10 7.62,43.84 9.28,43.84 10.16,44.72 10.16,45.49 11.86,47.19 19.68,47.19 v36.73,30.14
VCC  (via drill 0.3 pad 0.61)  (9 unrouted)
  Top 0.254: J3.1 21.72,45.11 C19.+ | IC2.31 22.51,17.27 v22.25,17.52 | v9.36,18.2 9.69,18.2 9.95,17.94 | 27.57,42.66 31.96,38.26 | C19.+ 27.53,42.7 27.57,42.66 | 27.57,42.66 31.25,46.33 40.69,46.33 J4.1 43.13,43.89 43.13,39.27 | C19.+ | IC2.6 21.15,29.77 20.33,28.95 12.31,28.95 11.2,30.06 11.2,30.17 11.2,30.61 IC1.11 v11.2,32.5 11.25,32.5 11.64,32.9 C2.1 | 32.17,10.69 32.17,10.32 C8.1 | 32.17,10.69 31.74,10.69 30.54,11.89 IC2.47 | 32.17,10.69 35.14,10.69 36.54,12.09 IC2.59 36.54,13.64 36.72,13.82 v43.01,13.82 | C1.1 9.95,17.94 | IC1.33 10.39,18.39 9.95,17.94 | C18.+ 9.96,12.22 11.85,10.32 | J1.18 10.16,3.2 10.16,7.08 11.85,8.77 R3.2 11.85,9.83 11.85,10.32 | 43.13,39.27 43.37,39.03 46.27,39.03 46.7,38.6 46.7,28.05 45.92,27.27 | 43.13,39.27 42.12,38.26 C13.1 42.12,37.1 42.12,36.71 41.54,36.12 IC2.112 | IC2.98 45.92,27.27 | 45.92,27.27 45.92,22.27 | v43.01,13.82 43.01,17.61 44.16,18.77 IC2.81 | 25.54,10.32 25.82,10.32 | 25.82,10.32 | 18.2,10.32 | 18.2,10.32 25.54,10.32 | 25.54,10.32 25.54,11.89 IC2.37 | 11.85,10.32 18.2,10.32 | R2.2 18.2,10.32 | v22.15,21.79 22.64,21.79 22.66,21.77 IC2.22 | v43.01,13.82 43.01,13.68 43.04,13.64 IC2.72 43.04,11.89 41.48,10.32 40.22,10.32 C9.2 | C7.1 25.82,10.32 | 31.96,38.26 37.05,38.26 C14.1 37.05,36.71 36.52,36.18 36.52,35.17 36.54,35.14 IC2.122 | 31.96,38.26 C15.1 31.96,36.71 31.04,35.78 IC2.133 | 45.92,22.27 45.92,21.97 45.72,21.77 45.48,21.77 IC2.87 | IC2.88 45.92,22.27 | IC2.14 22.49,25.77 v22.24,25.52
  Bottom 0.254: 23.28,17.52 v22.25,17.52 | 23.28,17.52 C5.1 23.28,22.39 22.87,22.39 22.86,22.39 | C6.1 23.28,17.52 | 9.26,18.2 9.26,30.57 v11.2,32.5 15.02,36.32 15.29,36.32 | J1.18 7.67,3.15 7.67,16.6 9.26,18.2 | 9.26,18.2 v9.36,18.2 | 40.69,32.81 42.8,32.81 44.59,31.03 44.59,29.45 45.94,28.1 C12.1 C11.1 C10.1 45.94,17.66 43.13,14.85 43.13,13.82 | 22.24,29.23 v22.24,25.52 22.36,25.52 22.45,25.42 22.86,25.42 | 15.29,36.32 22.24,29.37 22.24,29.23 | 22.24,29.23 22.45,29.23 C3.1 | 22.86,22.39 22.62,22.39 22.15,21.93 v22.15,21.79 | 22.86,25.42 22.86,22.39 | C4.1 22.86,25.42 | 15.29,36.32 15.29,43.88 J3.1 | 43.13,13.82 v43.01,13.82 | 43.13,13.82 43.13,3.15 J2.2 | 40.69,32.81 40.69,43.89 J4.1 | 40.69,32.81 37.88,30.01 R1.2
  pour Top: -2.54,48.92 50.8,48.92 50.8,-1.88 -2.54,-1.88

### Text on the board
tNames: PC / (S) | PA / (P) | EZ-Retro v2 | JCW, 2017